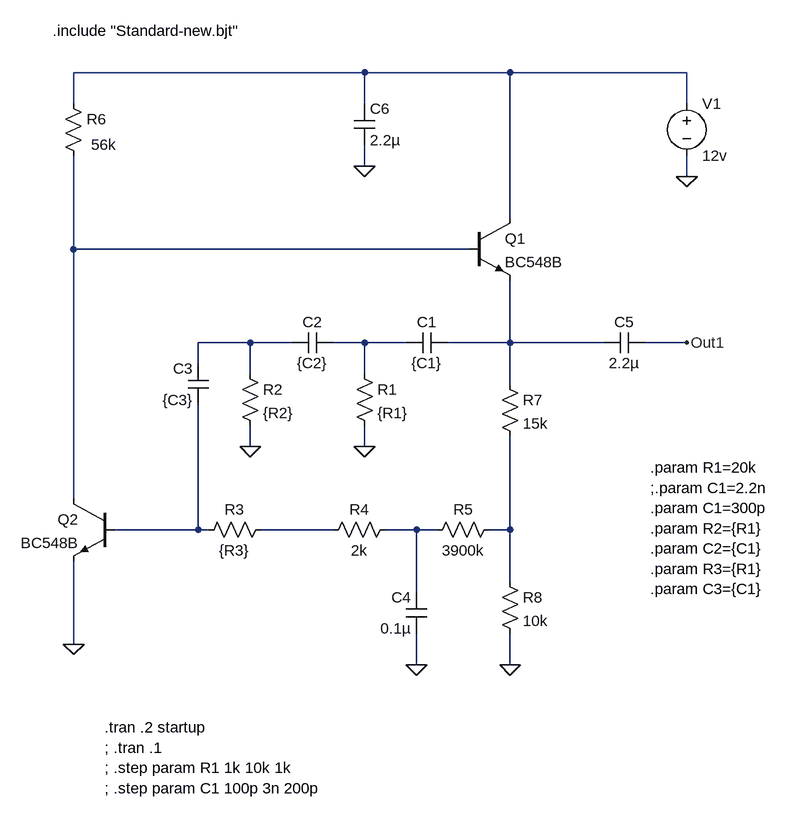
[diagram p0: schematic 3_1-OscillateurBF_type_RC.asc]
3_1-OscillateurBF_type_RC.asc, the LTspice schematic file:
Version 4
SHEET 1 1700 680
WIRE 0 -448 -448 -448
WIRE 224 -448 0 -448
WIRE 496 -448 224 -448
WIRE -448 -400 -448 -448
WIRE 0 -400 0 -448
WIRE 496 -400 496 -448
WIRE 0 -304 0 -336
WIRE 496 -288 496 -320
WIRE 224 -224 224 -448
WIRE -448 -176 -448 -320
WIRE 160 -176 -448 -176
WIRE -176 -32 -256 -32
WIRE -112 -32 -176 -32
WIRE 0 -32 -48 -32
WIRE 64 -32 0 -32
WIRE 224 -32 224 -128
WIRE 224 -32 128 -32
WIRE 368 -32 224 -32
WIRE 496 -32 432 -32
WIRE -256 0 -256 -32
WIRE -176 16 -176 -32
WIRE 0 16 0 -32
WIRE 224 32 224 -32
WIRE -176 128 -176 96
WIRE 0 128 0 96
WIRE -448 208 -448 -176
WIRE -256 256 -256 64
WIRE -256 256 -384 256
WIRE -240 256 -256 256
WIRE -48 256 -160 256
WIRE 80 256 32 256
WIRE 112 256 80 256
WIRE 224 256 224 112
WIRE 224 256 192 256
WIRE 224 336 224 256
WIRE 80 352 80 256
WIRE -448 432 -448 304
WIRE 80 464 80 416
WIRE 224 464 224 416
FLAG -176 128 0
FLAG 0 128 0
FLAG 80 464 0
FLAG 224 464 0
FLAG -448 432 0
FLAG 0 -304 0
FLAG 496 -288 0
FLAG 496 -32 Out1
SYMBOL npn 160 -224 R0
SYMATTR InstName Q1
SYMATTR Value BC548B
SYMBOL npn -384 208 M0
SYMATTR InstName Q2
SYMATTR Value BC548B
SYMBOL cap 64 -16 R270
WINDOW 0 32 32 VTop 2
WINDOW 3 0 32 VBottom 2
SYMATTR InstName C1
SYMATTR Value {C1}
SYMBOL cap -48 -48 R90
WINDOW 0 0 32 VBottom 2
WINDOW 3 32 32 VTop 2
SYMATTR InstName C2
SYMATTR Value {C2}
SYMBOL cap -240 64 R180
WINDOW 0 24 56 Left 2
WINDOW 3 24 8 Left 2
SYMATTR InstName C3
SYMATTR Value {C3}
SYMBOL cap 96 416 R180
WINDOW 0 24 56 Left 2
WINDOW 3 24 8 Left 2
SYMATTR InstName C4
SYMATTR Value 0.1µ
SYMBOL cap 432 -48 R90
WINDOW 0 0 32 VBottom 2
WINDOW 3 32 32 VTop 2
SYMATTR InstName C5
SYMATTR Value 2.2µ
SYMBOL res -16 0 R0
SYMATTR InstName R1
SYMATTR Value {R1}
SYMBOL res -192 0 R0
SYMATTR InstName R2
SYMATTR Value {R2}
SYMBOL res -144 240 R90
WINDOW 0 0 56 VBottom 2
WINDOW 3 32 56 VTop 2
SYMATTR InstName R3
SYMATTR Value {R3}
SYMBOL res 48 240 R90
WINDOW 0 0 56 VBottom 2
WINDOW 3 32 56 VTop 2
SYMATTR InstName R4
SYMATTR Value 2k
SYMBOL res 208 240 R90
WINDOW 0 0 56 VBottom 2
WINDOW 3 32 56 VTop 2
SYMATTR InstName R5
SYMATTR Value 3900k
SYMBOL res -464 -416 R0
WINDOW 3 43 79 Left 2
SYMATTR Value 56k
SYMATTR InstName R6
SYMBOL res 208 16 R0
SYMATTR InstName R7
SYMATTR Value 15k
SYMBOL res 208 320 R0
SYMATTR InstName R8
SYMATTR Value 10k
SYMBOL cap -16 -400 R0
SYMATTR InstName C6
SYMATTR Value 2.2µ
SYMBOL voltage 496 -416 R0
WINDOW 123 0 0 Left 0
WINDOW 39 0 0 Left 0
SYMATTR InstName V1
SYMATTR Value 12v
TEXT -480 -512 Left 2 !.include "Standard-new.bjt"
TEXT -400 560 Left 2 !.tran .2 startup\n; .tran .1\n; .step param R1 1k 10k 1k\n; .step param C1 100p 3n 200p
TEXT 440 160 Left 2 !.param R1=20k\n;.param C1=2.2n\n.param C1=300p\n.param R2={R1}\n.param C2={C1}\n.param R3={R1}\n.param C3={C1}

The netlist it stands for:
* 3_1-OscillateurBF_type_RC.asc
Q1 N001 N002 N005 0 BC548B
Q2 N002 N006 0 0 BC548B
C1 N004 N005 {C1}
C2 N004 N003 {C2}
C3 N006 N003 {C3}
C4 0 N008 0.1µ
C5 Out1 N005 2.2µ
R1 N004 0 {R1}
R2 N003 0 {R2}
R3 N007 N006 {R3}
R4 N008 N007 2k
R5 N009 N008 3900k
R6 N001 N002 56k
R7 N005 N009 15k
R8 N009 0 10k
C6 N001 0 2.2µ
V1 N001 0 12v
.model NPN NPN
.model PNP PNP
.lib standard.bjt
.include "Standard-new.bjt"
.tran .2 startup
; .tran .1
; .step param R1 1k 10k 1k
; .step param C1 100p 3n 200p
.param R1=20k
;.param C1=2.2n
.param C1=300p
.param R2={R1}
.param C2={C1}
.param R3={R1}
.param C3={C1}
.backanno
.end